# EasyEDA Pro project ProPrj_PRISM101 Scanner Backlight_2026-04-10.epro, schematic PRISM101 Backlight 4x6 RGBW
Assembly Variant: Basic; Board Name: Board1; Create Date: 2026-03-14; Page Name: P1; Project Name: PRISM Backlight; Schematic Name: Schematic1; Update Date: 2026-03-14; BladeWidth: 10; Page Size: A4; RegionStart: 1; ShowBorder: 1; TitleBlock: 1; TitleBlockPosition: 3; Version: V1.0; XRegionCount: 6; YRegionCount: 4
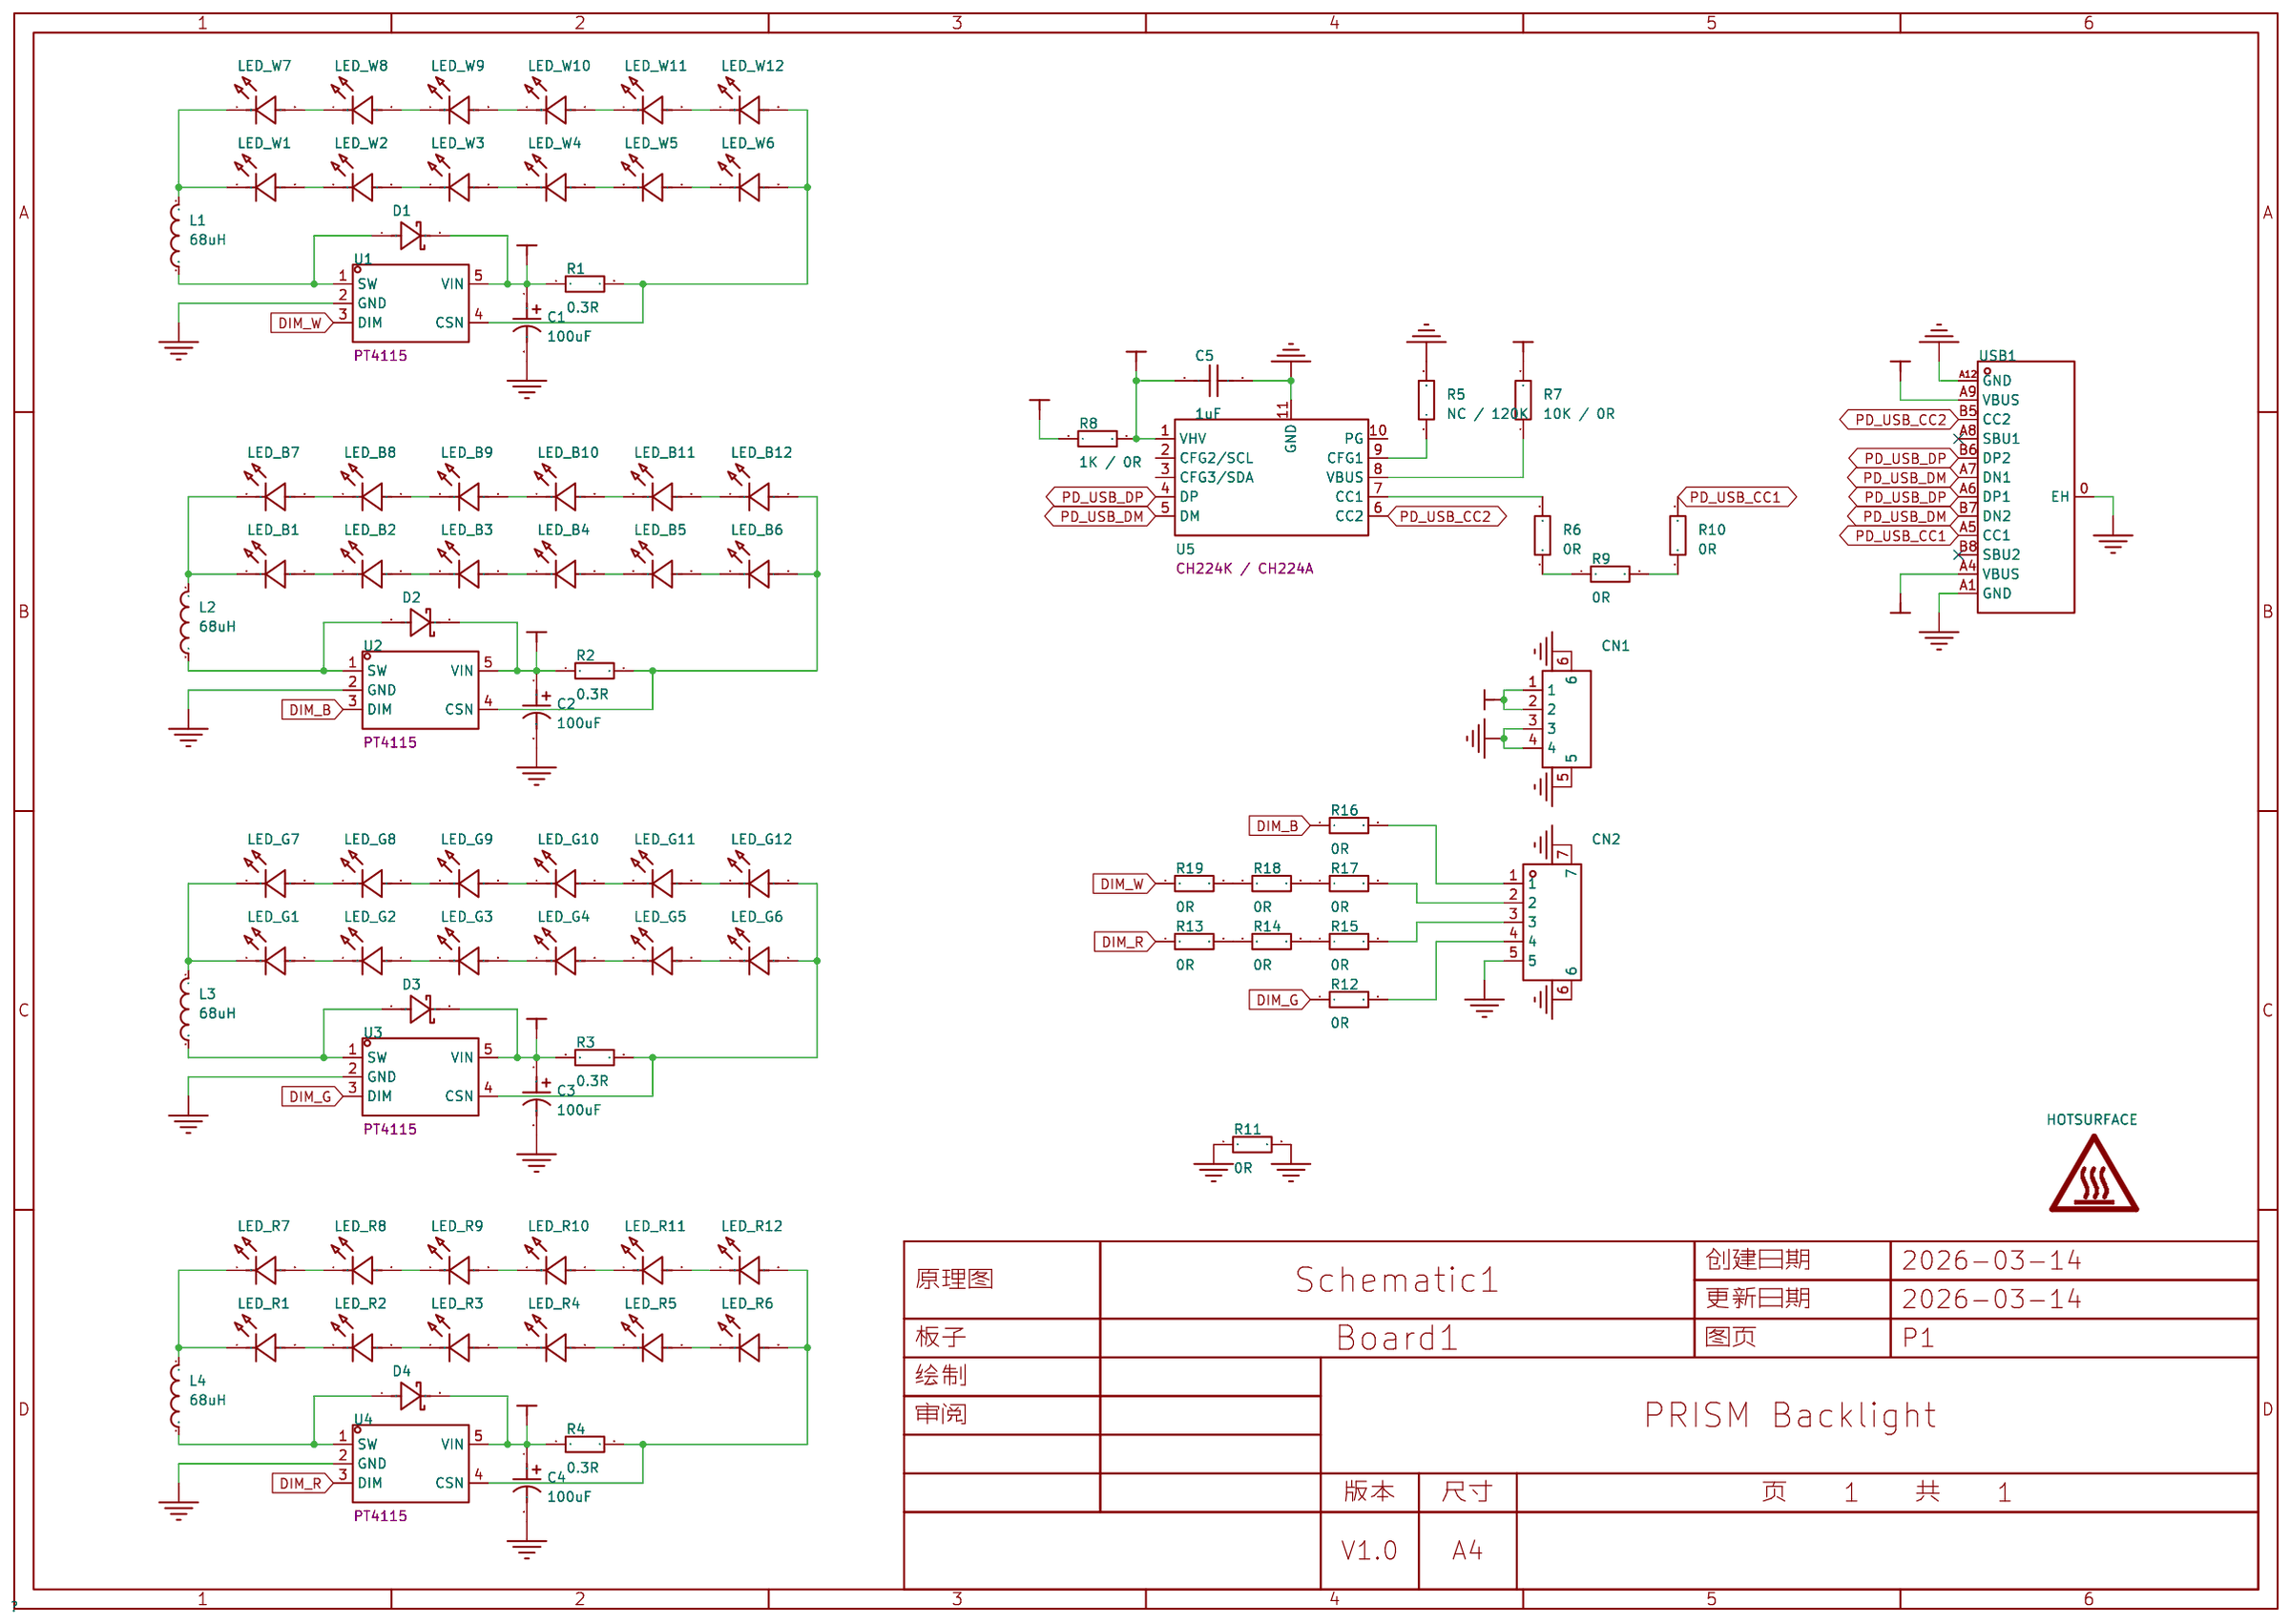
[diagram p1: schematic sheet]

## Parts
C1  100uF  [CAP-SMD_BD6.3-L6.6-W6.6-LS7.3-FD-H7.7]
C2  100uF  [CAP-SMD_BD6.3-L6.6-W6.6-LS7.3-FD-H7.7]
C3  100uF  [CAP-SMD_BD6.3-L6.6-W6.6-LS7.3-FD-H7.7]
C4  100uF  [CAP-SMD_BD6.3-L6.6-W6.6-LS7.3-FD-H7.7]
C5  1uF  [C0603]
CN1  UK-2.54-4ALT  [CONN-SMD_UK-2.54-4ALT]
CN2  UK-2.54-5ALT  [CONN-SMD_5P-P2.50_UK-2.54-5ALT]
D1  SS36  [SMA_L4.3-W2.6-LS5.0-FD]
D2  SS36  [SMA_L4.3-W2.6-LS5.0-FD]
D3  SS36  [SMA_L4.3-W2.6-LS5.0-FD]
D4  SS36  [SMA_L4.3-W2.6-LS5.0-FD]
HOTSURFACE  CAUTION HOT SURFACE  [IEC_HotSurface_Small]
L1  68uH  [IND-SMD_L7.1-W6.6_H5.0]
L2  68uH  [IND-SMD_L7.1-W6.6_H5.0]
L3  68uH  [IND-SMD_L7.1-W6.6_H5.0]
L4  68uH  [IND-SMD_L7.1-W6.6_H5.0]
LED_B1  JE2835ARY-N-0002A0000-N0000001  [LED-SMD_L3.5-W2.8-JE2835BWT-N]
LED_B2  JE2835ARY-N-0002A0000-N0000001  [LED-SMD_L3.5-W2.8-JE2835BWT-N]
LED_B3  JE2835ARY-N-0002A0000-N0000001  [LED-SMD_L3.5-W2.8-JE2835BWT-N]
LED_B4  JE2835ARY-N-0002A0000-N0000001  [LED-SMD_L3.5-W2.8-JE2835BWT-N]
LED_B5  JE2835ARY-N-0002A0000-N0000001  [LED-SMD_L3.5-W2.8-JE2835BWT-N]
LED_B6  JE2835ARY-N-0002A0000-N0000001  [LED-SMD_L3.5-W2.8-JE2835BWT-N]
LED_B7  JE2835ARY-N-0002A0000-N0000001  [LED-SMD_L3.5-W2.8-JE2835BWT-N]
LED_B8  JE2835ARY-N-0002A0000-N0000001  [LED-SMD_L3.5-W2.8-JE2835BWT-N]
LED_B9  JE2835ARY-N-0002A0000-N0000001  [LED-SMD_L3.5-W2.8-JE2835BWT-N]
LED_B10  JE2835ARY-N-0002A0000-N0000001  [LED-SMD_L3.5-W2.8-JE2835BWT-N]
LED_B11  JE2835ARY-N-0002A0000-N0000001  [LED-SMD_L3.5-W2.8-JE2835BWT-N]
LED_B12  JE2835ARY-N-0002A0000-N0000001  [LED-SMD_L3.5-W2.8-JE2835BWT-N]
LED_G1  JE2835AGR-N-0002A0000-N0000001  [LED-SMD_L3.5-W2.8-JE2835BWT-N]
LED_G2  JE2835AGR-N-0002A0000-N0000001  [LED-SMD_L3.5-W2.8-JE2835BWT-N]
LED_G3  JE2835AGR-N-0002A0000-N0000001  [LED-SMD_L3.5-W2.8-JE2835BWT-N]
LED_G4  JE2835AGR-N-0002A0000-N0000001  [LED-SMD_L3.5-W2.8-JE2835BWT-N]
LED_G5  JE2835AGR-N-0002A0000-N0000001  [LED-SMD_L3.5-W2.8-JE2835BWT-N]
LED_G6  JE2835AGR-N-0002A0000-N0000001  [LED-SMD_L3.5-W2.8-JE2835BWT-N]
LED_G7  JE2835AGR-N-0002A0000-N0000001  [LED-SMD_L3.5-W2.8-JE2835BWT-N]
LED_G8  JE2835AGR-N-0002A0000-N0000001  [LED-SMD_L3.5-W2.8-JE2835BWT-N]
LED_G9  JE2835AGR-N-0002A0000-N0000001  [LED-SMD_L3.5-W2.8-JE2835BWT-N]
LED_G10  JE2835AGR-N-0002A0000-N0000001  [LED-SMD_L3.5-W2.8-JE2835BWT-N]
LED_G11  JE2835AGR-N-0002A0000-N0000001  [LED-SMD_L3.5-W2.8-JE2835BWT-N]
LED_G12  JE2835AGR-N-0002A0000-N0000001  [LED-SMD_L3.5-W2.8-JE2835BWT-N]
LED_R1  JE2835AHR-N-0001A0000-N0000001  [LED-SMD_L3.5-W2.8_JE2835APO-N-0001A0000-N0000001]
LED_R2  JE2835AHR-N-0001A0000-N0000001  [LED-SMD_L3.5-W2.8_JE2835APO-N-0001A0000-N0000001]
LED_R3  JE2835AHR-N-0001A0000-N0000001  [LED-SMD_L3.5-W2.8_JE2835APO-N-0001A0000-N0000001]
LED_R4  JE2835AHR-N-0001A0000-N0000001  [LED-SMD_L3.5-W2.8_JE2835APO-N-0001A0000-N0000001]
LED_R5  JE2835AHR-N-0001A0000-N0000001  [LED-SMD_L3.5-W2.8_JE2835APO-N-0001A0000-N0000001]
LED_R6  JE2835AHR-N-0001A0000-N0000001  [LED-SMD_L3.5-W2.8_JE2835APO-N-0001A0000-N0000001]
LED_R7  JE2835AHR-N-0001A0000-N0000001  [LED-SMD_L3.5-W2.8_JE2835APO-N-0001A0000-N0000001]
LED_R8  JE2835AHR-N-0001A0000-N0000001  [LED-SMD_L3.5-W2.8_JE2835APO-N-0001A0000-N0000001]
LED_R9  JE2835AHR-N-0001A0000-N0000001  [LED-SMD_L3.5-W2.8_JE2835APO-N-0001A0000-N0000001]
LED_R10  JE2835AHR-N-0001A0000-N0000001  [LED-SMD_L3.5-W2.8_JE2835APO-N-0001A0000-N0000001]
LED_R11  JE2835AHR-N-0001A0000-N0000001  [LED-SMD_L3.5-W2.8_JE2835APO-N-0001A0000-N0000001]
LED_R12  JE2835AHR-N-0001A0000-N0000001  [LED-SMD_L3.5-W2.8_JE2835APO-N-0001A0000-N0000001]
LED_W1  JE2835BWT-N-U65EA0000-N0000001  [LED-SMD_L3.5-W2.8-JE2835BWT-N]
LED_W2  JE2835BWT-N-U65EA0000-N0000001  [LED-SMD_L3.5-W2.8-JE2835BWT-N]
LED_W3  JE2835BWT-N-U65EA0000-N0000001  [LED-SMD_L3.5-W2.8-JE2835BWT-N]
LED_W4  JE2835BWT-N-U65EA0000-N0000001  [LED-SMD_L3.5-W2.8-JE2835BWT-N]
LED_W5  JE2835BWT-N-U65EA0000-N0000001  [LED-SMD_L3.5-W2.8-JE2835BWT-N]
LED_W6  JE2835BWT-N-U65EA0000-N0000001  [LED-SMD_L3.5-W2.8-JE2835BWT-N]
LED_W7  JE2835BWT-N-U65EA0000-N0000001  [LED-SMD_L3.5-W2.8-JE2835BWT-N]
LED_W8  JE2835BWT-N-U65EA0000-N0000001  [LED-SMD_L3.5-W2.8-JE2835BWT-N]
LED_W9  JE2835BWT-N-U65EA0000-N0000001  [LED-SMD_L3.5-W2.8-JE2835BWT-N]
LED_W10  JE2835BWT-N-U65EA0000-N0000001  [LED-SMD_L3.5-W2.8-JE2835BWT-N]
LED_W11  JE2835BWT-N-U65EA0000-N0000001  [LED-SMD_L3.5-W2.8-JE2835BWT-N]
LED_W12  JE2835BWT-N-U65EA0000-N0000001  [LED-SMD_L3.5-W2.8-JE2835BWT-N]
R1  0.3R  [R1206]
R2  0.3R  [R1206]
R3  0.3R  [R1206]
R4  0.3R  [R1206]
R5  NC / 120K  [R0603]
R6  0R  [R0603]
R7  10K / 0R  [R0603]
R8  1K / 0R  [R0603]
R9  0R  [R0603]
R10  0R  [R0603]
R11  0R  [R1206]
R12  0R  [R1206]
R13  0R  [R1206]
R14  0R  [R1206]
R15  0R  [R1206]
R16  0R  [R1206]
R17  0R  [R1206]
R18  0R  [R1206]
R19  0R  [R1206]
U1  PT4115  [SOT-89-5_L4.5-W2.5-P1.50-LS4.5-BR]
U2  PT4115  [SOT-89-5_L4.5-W2.5-P1.50-LS4.5-BR]
U3  PT4115  [SOT-89-5_L4.5-W2.5-P1.50-LS4.5-BR]
U4  PT4115  [SOT-89-5_L4.5-W2.5-P1.50-LS4.5-BR]
U5  CH224K / CH224A  [ESSOP-10_L4.9-W3.9-P1.0-LS6.0-TL-EP]
USB1  TYPE-C 16P QTWT  [USB-TYPE-C-SMD_TYPE-C-16P-QTWT]

## Library data of the parts
C1-C4 = JVJ50V100M6x8: 容值:100uF;精度:±20%;额定电压:50V;纹波电流:140mA@120Hz;; LCSC Part Name: 100uF ±20% 50V; Supplier Part: C46550415; Manufacturer: JIERR(捷而瑞); Supplier Footprint: SMD,D6.3xL7.7mm; JLCPCB Part Class: Extended Part; Datasheet: https://item.szlcsc.com/datasheet/JVJ50V100M6x8/48680109.html; Supplier: LCSC; Tolerance: ±20%; Voltage Rating: 50V; Ripple Current: 140mA@120Hz; Diameter: 6.3mm; Height - Seated (Max): 7.7mm; Lifetime: 2000hrs@105℃; Operating Temperature: -55℃~+105℃
C5 = CAP_0603: Supplier Footprint: 0603
CN1 = UK-2.54-4ALT: 插针结构:1x4P;间距:2.54mm;安装方式:立贴;参考系列:XH;总PIN数:4P;排数:1;每排PIN数:4;额定电流:3A;触头材质:黄铜;触头镀层:锡;工作温度:-25℃~+85℃;; LCSC Part Name: 1x4P 间距:2.54mm 立贴 系列:XH; Supplier Part: C2997413; Manufacturer: USAKRO(美韩); Supplier Footprint: SMD,P=2.54mm; JLCPCB Part Class: Extended Part; Datasheet: https://item.szlcsc.com/datasheet/UK-2.54-4ALT/3468324.html; Supplier: LCSC; Pins Structure: 1x4P; Pitch: 2.54mm; Mounting Type: 立贴; Reference Series: XH; Number of Pins: 4P; Number of Rows: 1; Number of PINs Per Row: 4; Current Rating: 3A; Contact Material: 黄铜; Contact Plating: 锡; Operating Temperature: -25℃~+85℃; Voltage Rating: 250V; Plastic Material: LCP; Flame Retardant Rating: UL94V-0; Z-Height of the Board: 7.9mm; Y-Width of Bottom Edge on Board: 7.8mm
CN2 = UK-2.54-5ALT: 插针结构:1x5P;间距:2.54mm;安装方式:立贴;参考系列:XH;总PIN数:5P;排数:1;每排PIN数:5;额定电流:3A;触头材质:黄铜;触头镀层:锡;工作温度:-25℃~+85℃;; LCSC Part Name: 1x5P 间距:2.54mm 立贴 系列:XH; Supplier Part: C2997414; Manufacturer: USAKRO(美韩); Supplier Footprint: SMD,P=2.54mm; JLCPCB Part Class: Extended Part; Datasheet: https://item.szlcsc.com/datasheet/UK-2.54-5ALT/3468325.html; Supplier: LCSC; Pins Structure: 1x5P; Pitch: 2.54mm; Mounting Type: 立贴; Reference Series: XH; Number of Pins: 5P; Number of Rows: 1; Number of PINs Per Row: 5; Current Rating: 3A; Contact Material: 黄铜; Contact Plating: 锡; Operating Temperature: -25℃~+85℃; Voltage Rating: 250V; Plastic Material: LCP; Flame Retardant Rating: UL94V-0; Z-Height of the Board: 7.9mm; Y-Width of Bottom Edge on Board: 7.8mm
D1-D4 = SS36_C7420367: 二极管配置:独立式;正向压降(Vf):700mV@3.0A;直流反向耐压(Vr):60V;整流电流:3A;; LCSC Part Name: 电压:60V 电流:3A; Supplier Part: C7420367; Manufacturer: R+O(宏嘉诚); Supplier Footprint: SMA(DO-214AC); JLCPCB Part Class: Extended Part; Datasheet: https://item.szlcsc.com/datasheet/SS36/8397189.html; Supplier: LCSC; Diode Configuration: 独立式; Voltage - Forward(Vf@If): 700mV@3.0A; Voltage - DC Reverse(Vr): 60V; Current - Rectified: 3A; Reverse Leakage Current (Ir): 10mA@60V; Operating Junction Temperature Range: -55℃~+150℃; Non-Repetitive Peak Forward Surge Current: 80A
HOTSURFACE = CAUTION HOT SURFACE: SymbolVersion: 2011-08-22; SymbolCreator: a0412235; Published: 2009-03-03; Publisher: Texas Instruments; LatestRevisionDate: 2016-03-21; Origin Footprint 1: IEC_HotSurface_Large; Origin Footprint 2: IEC_HotSurface_Medium
L1-L4 = SMMS0650-680M: 电感值:68uH;精度:±20%;额定电流:1.5A;饱和电流(Isat):2A;类型:-;; LCSC Part Name: 68uH ±20% 2A; Supplier Part: C2894721; Manufacturer: SXN(顺翔诺); Supplier Footprint: SMD,6.6x7.1mm; JLCPCB Part Class: Extended Part; Datasheet: https://item.szlcsc.com/datasheet/SMMS0650-680M/3130468.html; Supplier: LCSC; Tolerance: ±20%; Current Rating: 1.5A; Current - Saturation(Isat): 2A; DC Resistance(DCR): 442mΩ
LED_B1-LED_B12 = JE2835BWT-N-U30EA0000-N0000001: 发光颜色:-;正向压降(Vf):2.86V;正向电流:150mA;色温:3000K;发光角度:120°;; Supplier Part: D2357181; Manufacturer: CREE LED; Supplier Footprint: SMD2835; JLCPCB Part Class: Extended Part; Datasheet: https://item.szlcsc.com/datasheet/JE2835BWT-N-U30EA0000-N0000001/18618742.html; Supplier: LCSC; Illumination Color: 蓝色; Voltage - Forward(Vf): 2.86V; Forward Current: 140mA; Color Temperature: 3000K; Viewing Angle: 120°
LED_G1-LED_G12 = JE2835BWT-N-U30EA0000-N0000001: 发光颜色:-;正向压降(Vf):2.86V;正向电流:150mA;色温:3000K;发光角度:120°;; Supplier Part: D2357208; Manufacturer: CREE LED; Supplier Footprint: SMD2835; JLCPCB Part Class: Extended Part; Datasheet: https://item.szlcsc.com/datasheet/JE2835BWT-N-U30EA0000-N0000001/18618742.html; Supplier: LCSC; Illumination Color: 绿色; Voltage - Forward(Vf): 2.86V; Forward Current: 140mA; Color Temperature: 3000K; Viewing Angle: 120°
LED_R1-LED_R12 = JE2835AHR-N-0001A0000-N0000001: 灯头类型:-;发光颜色:红色;正向压降(Vf):2.15V;功率:500mW;正向电流:140mA;波长:585nm~595nm;二极管配置:独立二极管;透镜颜色:-;色温:-;发光强度:-;发光角度:121°;载带方式:-;工作温度:-40℃~+105℃;; LCSC Part Name: 红色; Supplier Part: C17235048; Manufacturer: CREE LED; Supplier Footprint: SMD2835-2P; JLCPCB Part Class: Extended Part; Datasheet: https://item.szlcsc.com/datasheet/JE2835AHR-N-0001A0000-N0000001/18364153.html; Supplier: LCSC; Illumination Color: 红色; Voltage - Forward(Vf): 2.15V; Power(Watts): 500mW; Forward Current: 140mA; Wavelength - Dominant: 585nm~595nm; Diode Configuration: 独立二极管; Viewing Angle: 121°; Operating Temperature: -40℃~+105℃
LED_W1-LED_W12 = JE2835BWT-N-U30EA0000-N0000001: 发光颜色:-;正向压降(Vf):2.86V;正向电流:150mA;色温:6500K;发光角度:120°;; Supplier Part: D2358647; Manufacturer: CREE LED; Supplier Footprint: SMD2835; JLCPCB Part Class: Extended Part; Datasheet: https://item.szlcsc.com/datasheet/JE2835BWT-N-U30EA0000-N0000001/18618742.html; Supplier: LCSC; Voltage - Forward(Vf): 2.86V; Forward Current: 150mA; Color Temperature: 6500K; Viewing Angle: 120°
R1-R4 R11-R19 = Res_1206: Supplier Footprint: 1206
R5-R10 = Res_0603: Supplier Footprint: 0603
U1-U4 = PT4115_C347356: 类型:DC-DC;工作电压(DC):6V~30V;开关频率:1MHz;通道数:-;输出电压:-;输出电流:1.2A;调光:PWM；模拟;拓扑结构:降压;; LCSC Part Name: 30 V/1.2 A高调光比LED恒流驱动器; Supplier Part: C347356; Manufacturer: UMW(友台半导体); Supplier Footprint: SOT-89-5; JLCPCB Part Class: Extended Part; Datasheet: https://item.szlcsc.com/datasheet/PT4115/324016.html; Supplier: LCSC; Type: DC-DC; Voltage - Input(DC): 6V~30V; Frequency - Switching: 1MHz; Output Current: 1.2A; Dimming: PWM；模拟; Features: 过温保护(OTP); Topology: 降压; Operating temperature: -25℃~+85℃; Switch Tube (Built-In/External): 内置; Constant Current Accuracy: 5%
U5 = CH224A: 支持USB PD3.2的USB PD快充协议受电芯片，最高支持PD3.2 EPR 140W功率,可广泛用于各类电子设备拓展高功率输入如无线充电器、小家电、锂电池电动工具等各类场合。; Supplier Part: C42459160; Manufacturer: WCH(南京沁恒); Supplier Footprint: ESSOP-10; JLCPCB Part Class: Extended Part; Datasheet: https://item.szlcsc.com/datasheet/CH224A/44538670.html; Supplier: LCSC; Type: 受电控制器; Output Power: 140W; Output Voltage: 5V；20V；15V；12V；28V；9V; Operating Temperature: -40℃~+105℃
USB1 = TYPE-C 16P QTWT: 连接器类型:Type-C;协议标准:-;公母:母;安装方式:卧贴;触点数量:16P;端口数量:1;额定电流 - 电源:3A;工作温度:-25℃~+85℃;; LCSC Part Name: 16P卧贴母座; Supplier Part: C5187472; Manufacturer: SHOU HAN(首韩); Supplier Footprint: SMD; JLCPCB Part Class: Extended Part; Datasheet: https://item.szlcsc.com/datasheet/TYPE-C%252016P%2520QTWT/5860367.html; Supplier: LCSC; Connector Type: Type-C; Gender: 母; Mounting Type: 卧贴; Number of Contacts: 16P; Number of Ports: 1; Current Rating-Power: 3A; Voltage Rating: 5V; Connect-Disconnect Life: 5千次; Detection color: 黑色; Operating Temperature: -25℃~+85℃

## Nets
GND: C1.2 C2.2 C3.2 C4.2 C5.2 CN1.3 CN1.4 CN1.5 CN1.6 CN2.5 CN2.6 CN2.7 R5.2 R11.1 R11.2 U1.2(GND) U2.2(GND) U3.2(GND) U4.2(GND) U5.11(GND) USB1.0(EH) USB1.A1(GND) USB1.A12(GND)
VCC: C1.1 C2.1 C3.1 C4.1 CN1.1 CN1.2 D1.2(K) D2.2(K) D3.2(K) D4.2(K) R1.1 R2.1 R3.1 R4.1 R7.2 R8.1 U1.5(VIN) U2.5(VIN) U3.5(VIN) U4.5(VIN) USB1.A4(VBUS) USB1.A9(VBUS)
VDD: C5.1 R8.2 U5.1(VHV)
DIM_B: R16.1 U2.3(DIM)
DIM_G: R12.1 U3.3(DIM)
DIM_R: R13.1 U4.3(DIM)
DIM_W: R19.1 U1.3(DIM)
PD_USB_CC1: R10.2 USB1.A5(CC1)
PD_USB_CC2: U5.6(CC2) USB1.B5(CC2)
PD_USB_DM: U5.5(DM) USB1.A7(DN1) USB1.B7(DN2)
PD_USB_DP: U5.4(DP) USB1.A6(DP1) USB1.B6(DP2)
$1N6: LED_R6.2(A) LED_R12.2(A) R4.2 U4.4(CSN)
$1N14: D4.1(A) L4.2 U4.1(SW)
$1N15: L4.1 LED_R1.1(C) LED_R7.1(C)
$1N18: LED_G6.2(A) LED_G12.2(A) R3.2 U3.4(CSN)
$1N19: D3.1(A) L3.2 U3.1(SW)
$1N20: L3.1 LED_G1.1(C) LED_G7.1(C)
$1N22: LED_G1.2(A) LED_G2.1(C)
$1N23: LED_G2.2(A) LED_G3.1(C)
$1N24: LED_G3.2(A) LED_G4.1(C)
$1N28: LED_B6.2(A) LED_B12.2(A) R2.2 U2.4(CSN)
$1N29: D2.1(A) L2.2 U2.1(SW)
$1N30: L2.1 LED_B1.1(C) LED_B7.1(C)
$1N32: LED_B1.2(A) LED_B2.1(C)
$1N33: LED_B2.2(A) LED_B3.1(C)
$1N34: LED_B3.2(A) LED_B4.1(C)
$1N38: LED_W6.2(A) LED_W12.2(A) R1.2 U1.4(CSN)
$1N39: D1.1(A) L1.2 U1.1(SW)
$1N40: L1.1 LED_W1.1(C) LED_W7.1(C)
$1N42: LED_W1.2(A) LED_W2.1(C)
$1N43: LED_W2.2(A) LED_W3.1(C)
$1N44: LED_W3.2(A) LED_W4.1(C)
$1N66: R5.1 U5.9(CFG1)
$1N75: R6.2 U5.7(CC1)
$1N76: R7.1 U5.8(VBUS)
$1N80: R9.2 R10.1
$1N82: R6.1 R9.1
$1N102: CN2.4 R12.2
$1N104: R13.2 R14.1
$1N105: R14.2 R15.1
$1N106: CN2.3 R15.2
$1N110: CN2.2 R17.2
$1N111: CN2.1 R16.2
$1N112: R17.1 R18.2
$1N114: R18.1 R19.2
$1N115: LED_W4.2(A) LED_W5.1(C)
$1N116: LED_W5.2(A) LED_W6.1(C)
$1N117: LED_B4.2(A) LED_B5.1(C)
$1N118: LED_B5.2(A) LED_B6.1(C)
$1N119: LED_G4.2(A) LED_G5.1(C)
$1N120: LED_G5.2(A) LED_G6.1(C)
$1N121: LED_R4.2(A) LED_R5.1(C)
$1N122: LED_R5.2(A) LED_R6.1(C)
$1N123: LED_R11.2(A) LED_R12.1(C)
$1N124: LED_R10.2(A) LED_R11.1(C)
$1N128: LED_G11.2(A) LED_G12.1(C)
$1N129: LED_G10.2(A) LED_G11.1(C)
$1N131: LED_G7.2(A) LED_G8.1(C)
$1N132: LED_G8.2(A) LED_G9.1(C)
$1N133: LED_G9.2(A) LED_G10.1(C)
$1N134: LED_B11.2(A) LED_B12.1(C)
$1N135: LED_B10.2(A) LED_B11.1(C)
$1N137: LED_B7.2(A) LED_B8.1(C)
$1N138: LED_B8.2(A) LED_B9.1(C)
$1N139: LED_B9.2(A) LED_B10.1(C)
$1N140: LED_W11.2(A) LED_W12.1(C)
$1N141: LED_W10.2(A) LED_W11.1(C)
$1N143: LED_W7.2(A) LED_W8.1(C)
$1N144: LED_W8.2(A) LED_W9.1(C)
$1N145: LED_W9.2(A) LED_W10.1(C)
$1N148: LED_R1.2(A) LED_R2.1(C)
$1N149: LED_R7.2(A) LED_R8.1(C)
$1N150: LED_R8.2(A) LED_R9.1(C)
$1N151: LED_R2.2(A) LED_R3.1(C)
$1N152: LED_R9.2(A) LED_R10.1(C)
$1N153: LED_R3.2(A) LED_R4.1(C)

Not connected (* = marked no-connect by the designer): U5 2(CFG2/SCL) 3(CFG3/SDA) 10(PG); USB1 A8(SBU1)* B8(SBU2)*
